# EAGLE design breakout (EAGLE 6.5.0)
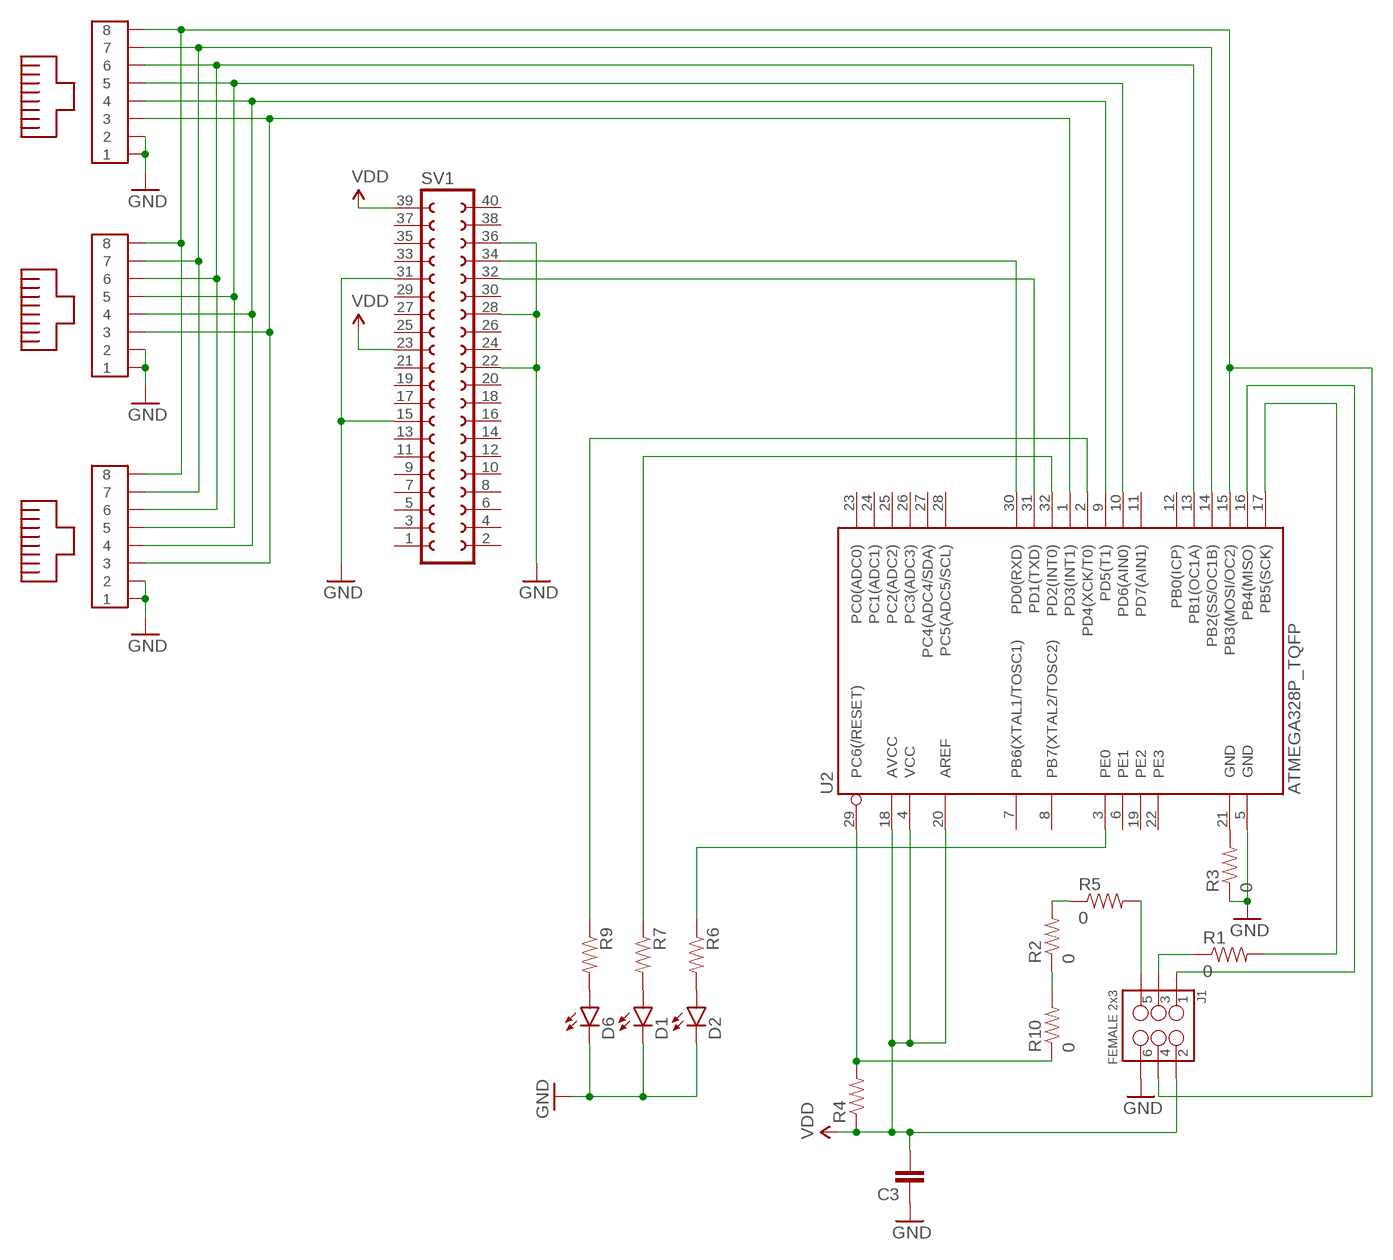
[diagram p0: schematic, sheet 1]

## Parts
C3  CAP1206  [1206]
D1  LED0603  [LED-0603]
D2  LED0603  [LED-0603]
D6  LED0603  [LED-0603]
J1  FEMALE 2x3  M03X2FEMALE  [2X3]
R1  0  RESISTOR1206  [1206]
R2  0  RESISTOR1206  [1206]
R3  0  RESISTOR1206  [1206]
R4  RESISTOR1206  [1206]
R5  0  RESISTOR1206  [1206]
R6  RESISTOR1206  [1206]
R7  RESISTOR1206  [1206]
R9  RESISTOR1206  [1206]
R10  0  RESISTOR1206  [1206]
SV1  FE20-2  [FE20-2]
U2  ATMEGA328P_TQFP  [TQFP32-08]
U$2  MOLEX-RJ45-SMT  [MOLEX-RJ45-SMT]
U$3  MOLEX-RJ45-SMT  [MOLEX-RJ45-SMT]
U$4  MOLEX-RJ45-SMT  [MOLEX-RJ45-SMT]

## Nets
GND: C3.1 D1.C D2.C D6.C J1.6 R3.1 SV1.15 SV1.22 SV1.28 SV1.31 SV1.36 U2.5(GND) U$2.1 U$2.2 U$3.1 U$3.2 U$4.1 U$4.2
N$1: SV1.32 U2.31(PD1(TXD))
N$2: R4.2 R10.1 U2.29(PC6(/RESET))
N$3: U2.9(PD5(T1)) U$2.4 U$3.4 U$4.4
N$4: U2.1(PD3(INT1)) U$2.3 U$3.3 U$4.3
N$5: J1.4 U2.15(PB3(MOSI/OC2)) U$2.8 U$3.8 U$4.8
N$6: U2.10(PD6(AIN0)) U$2.5 U$3.5 U$4.5
N$7: D2.A R6.2
N$8: J1.5 R5.2
N$9: R9.1 U2.2(PD4(XCK/T0))
N$10: SV1.34 U2.30(PD0(RXD))
N$11: J1.3 R1.1
N$12: U2.13(PB1(OC1A)) U$2.6 U$3.6 U$4.6
N$13: U2.14(PB2(SS/OC1B)) U$2.7 U$3.7 U$4.7
N$14: J1.1 U2.16(PB4(MISO))
N$15: R6.1 U2.3(PE0)
N$16: R2.2 R5.1
N$17: R1.2 U2.17(PB5(SCK))
N$18: D1.A R7.2
N$19: R7.1 U2.32(PD2(INT0))
N$20: D6.A R9.2
N$21: R2.1 R10.2
N$22: R3.2 U2.21(GND)
VDD: C3.2 J1.2 R4.1 SV1.23 SV1.39 U2.4(VCC) U2.18(AVCC) U2.20(AREF)
Unconnected: SV1.1 SV1.2 SV1.3 SV1.4 SV1.5 SV1.6 SV1.7 SV1.8 SV1.9 SV1.10 SV1.11 SV1.12 SV1.13 SV1.14 SV1.16 SV1.17 SV1.18 SV1.19 SV1.20 SV1.21 SV1.24 SV1.25 SV1.26 SV1.27 SV1.29 SV1.30 SV1.33 SV1.35 SV1.37 SV1.38 SV1.40 U2.6(PE1) U2.7(PB6(XTAL1/TOSC1)) U2.8(PB7(XTAL2/TOSC2)) U2.11(PD7(AIN1)) U2.12(PB0(ICP)) U2.19(PE2) U2.22(PE3) U2.23(PC0(ADC0)) U2.24(PC1(ADC1)) U2.25(PC2(ADC2)) U2.26(PC3(ADC3)) U2.27(PC4(ADC4/SDA)) U2.28(PC5(ADC5/SCL))

## Library data of the parts
C3 = SparkFun-Capacitors:CAP: Capacitor Standard 0603 ceramic capacitor, and 0.1" leaded capacitor.
D1 D2 D6 = SparkFun-LED:LED: LEDs Standard schematic elements and footprints for 5mm, 3mm, 1206, and 0603 sized LEDs. 5mm - Spark Fun Electronics SKU : COM-00529 (and others)
J1 = SparkFun-Connectors:M03X2: 2x3 .1" header. Shrouded, with keying- CONN-10681 SMT- CONN-11415 Pogo pins- HW-11044; PROD_ID: CONN-11566
R1-R7 R9 R10 = SparkFun-Resistors:RESISTOR: Resistor Basic schematic elements and footprints for 0603, 1206, and PTH resistors.
SV1 = con-lsta:FE20-2: FEMALE HEADER; OC_FARNELL: unknown; OC_NEWARK: unknown
U2 = custom-mlane:ATMEGA328P_TQFP; PROD_ID: IC-09069; VALUE: ATMEGA328PB_TQFP
U$2-U$4 = SMD-RJ45:MOLEX-RJ45-SMT

## Board
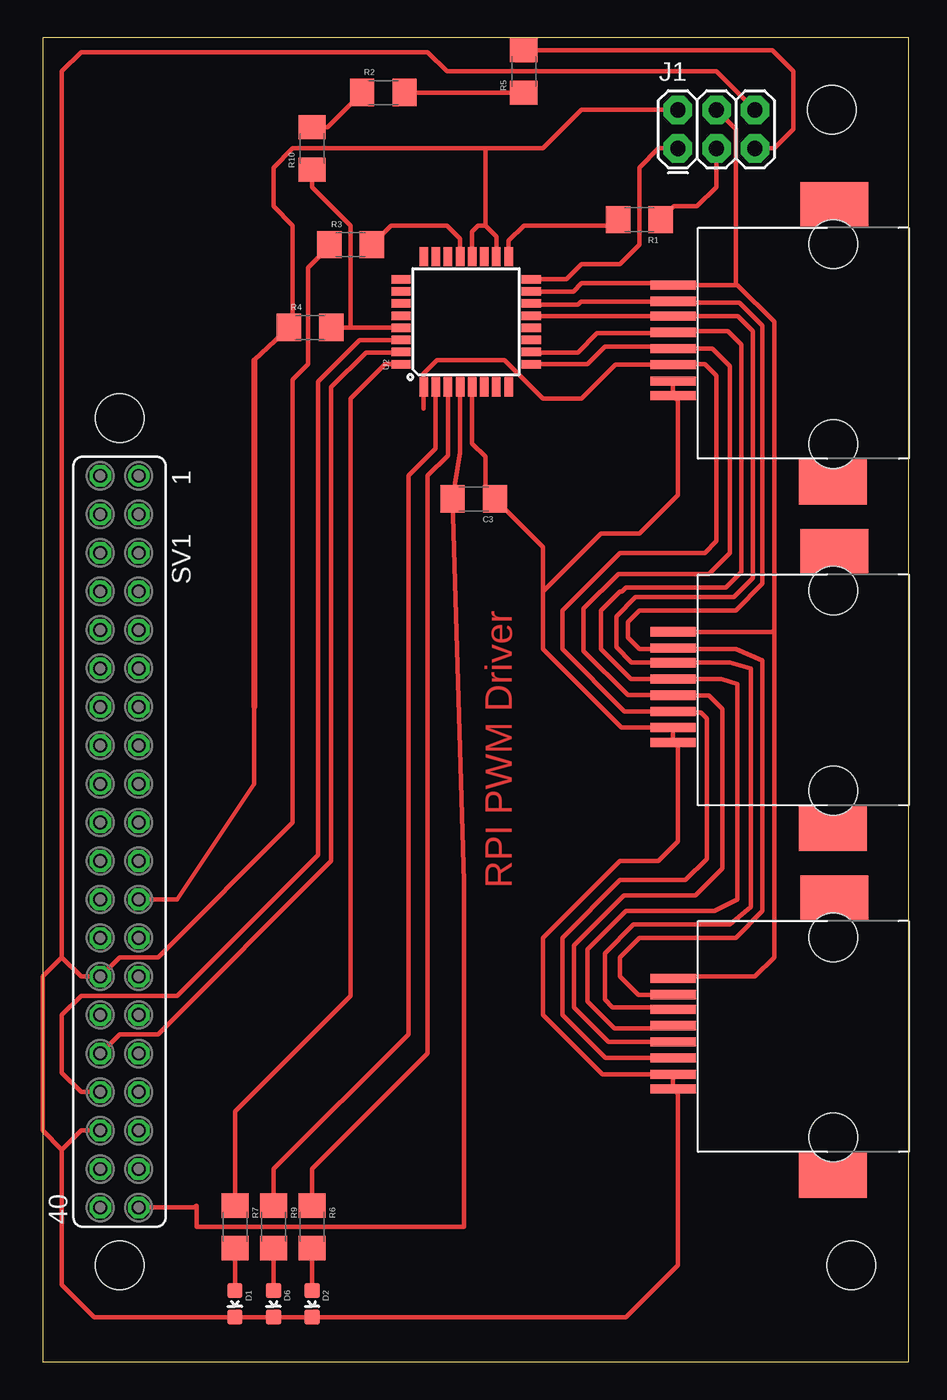
[diagram p1: board, top side]
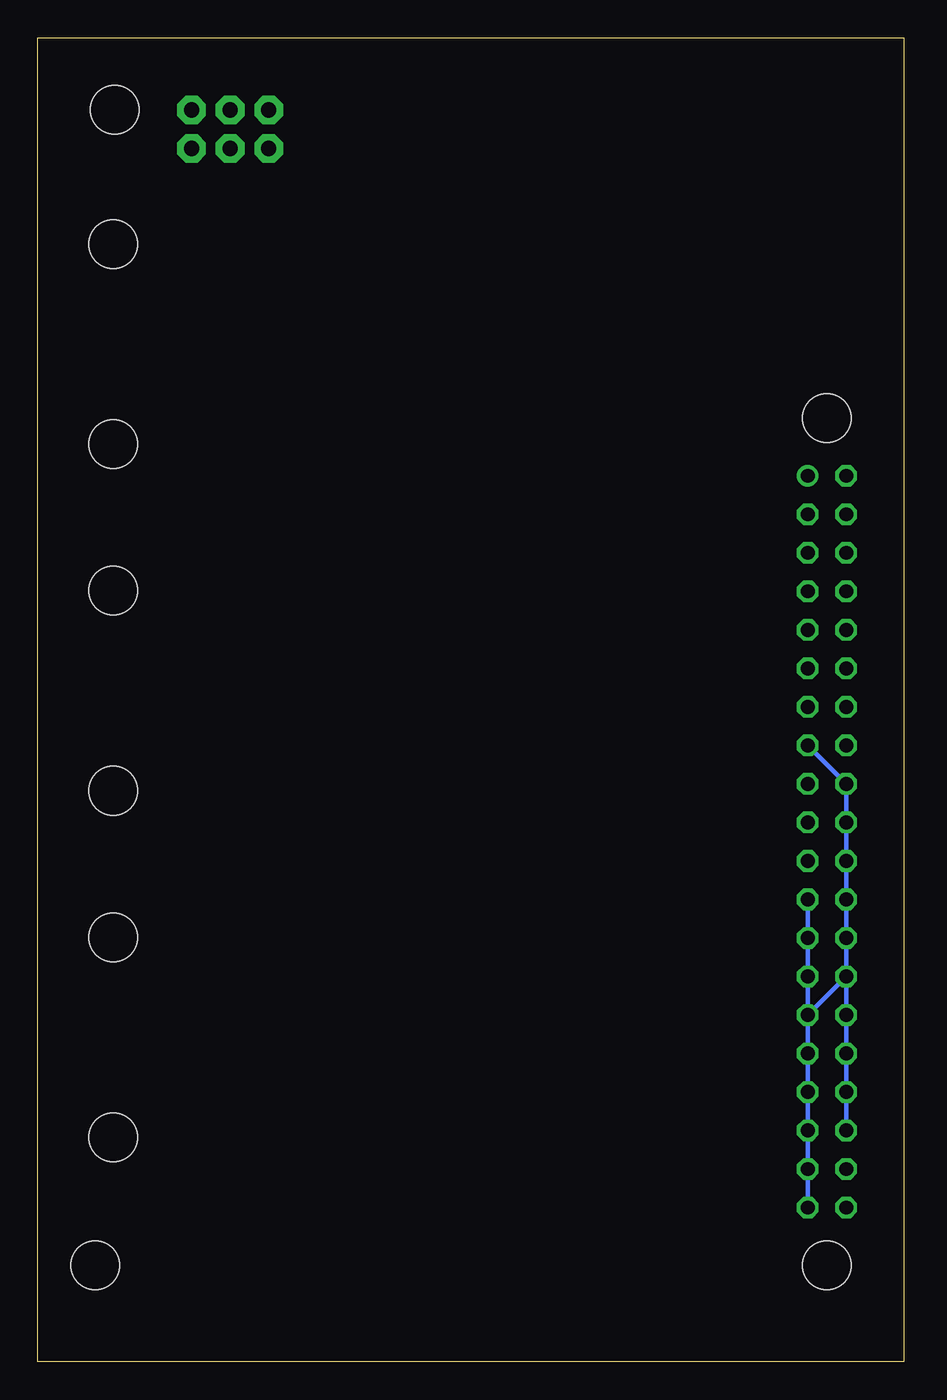
[diagram p2: board, bottom side, seen from below]

Size 57.13 x 87.3 mm. Coordinates in mm from the lower left corner, seen from the top.
Outline: 0,0 57.13,0 57.13,87.3 0,87.3 0,0
Copper layers (1*16): Top 0.035mm / dielectric 1.5mm / Bottom 0.035mm
Design rules "default": minimum track width 10mil, minimum drill 24mil, track to track 8mil, track to pad 8mil, pad to pad 8mil, via to via 8mil, smd to smd 8mil, copper to edge 40mil, drill to drill 8mil, minimum pad ring 10mil, minimum via ring 8mil, stop-mask expansion 4mil, vias tented up to drill 0mil, thermal gap 10mil
Holes 3.2 mm at 52.07,82.55 5.08,6.35 53.34,6.35 5.08,62.23

### Footprints (pad centres in the part's own frame; a part is rotated, then mirrored left to right if it is on the bottom)
1206 = smd 1.6 x 1.8: 1 -1.4,0; 2 1.4,0
LED-0603 = smd 1 x 1: A 0,-0.877; C 0,0.877
2X3 = drill 1.016 pad 1.88 octagon: 1 0,0; 2 0,2.54; 3 2.54,0; 4 2.54,2.54; 5 5.08,0; 6 5.08,2.54
FE20-2 = drill 0.914: 1 -24.13,1.27 | drill 0.914 octagon: 2 -24.13,-1.27; 3 -21.59,1.27; 4 -21.59,-1.27; 5 -19.05,1.27; 6 -19.05,-1.27; 7 -16.51,1.27; 8 -16.51,-1.27; 9 -13.97,1.27; 10 -13.97,-1.27; 11 -11.43,1.27; 12 -11.43,-1.27; 13 -8.89,1.27; 14 -8.89,-1.27; 15 -6.35,1.27; 16 -6.35,-1.27; 17 -3.81,1.27; 18 -3.81,-1.27; 19 -1.27,1.27; 20 -1.27,-1.27; 21 1.27,1.27; 22 1.27,-1.27; 23 3.81,1.27; 24 3.81,-1.27; 25 6.35,1.27; 26 6.35,-1.27; 27 8.89,1.27; 28 8.89,-1.27; 29 11.43,1.27; 30 11.43,-1.27; 31 13.97,1.27; 32 13.97,-1.27; 33 16.51,1.27; 34 16.51,-1.27; 35 19.05,1.27; 36 19.05,-1.27; 37 21.59,1.27; 38 21.59,-1.27; 39 24.13,1.27; 40 24.13,-1.27
TQFP32-08 = smd 1.27 x 0.559: 1 -4.293,2.8; 2 -4.293,2; 3 -4.293,1.2; 4 -4.293,0.4; 5 -4.293,-0.4; 6 -4.293,-1.2; 7 -4.293,-2; 8 -4.293,-2.8; 17 4.293,-2.8; 18 4.293,-2; 19 4.293,-1.2; 20 4.293,-0.4; 21 4.293,0.4; 22 4.293,1.2; 23 4.293,2; 24 4.293,2.8 | smd 0.559 x 1.27: 9 -2.8,-4.293; 10 -2,-4.293; 11 -1.2,-4.293; 12 -0.4,-4.293; 13 0.4,-4.293; 14 1.2,-4.293; 15 2,-4.293; 16 2.8,-4.293; 25 2.8,4.293; 26 2,4.293; 27 1.2,4.293; 28 0.4,4.293; 29 -0.4,4.293; 30 -1.2,4.293; 31 -2,4.293; 32 -2.8,4.293
MOLEX-RJ45-SMT = smd 3 x 0.6: 1 10.48,3.61; 2 10.48,2.64; 3 10.48,1.57; 4 10.48,0.5; 5 10.48,-0.57; 6 10.48,-1.64; 7 10.48,-2.61; 8 10.48,-3.68 | smd 4.5 x 3: P$1 -0.16,-8.97; P$2 -0.06,9.28 | hole 3.2: -0.1,6.8; -0.1,-6.4

### Placement (x,y rotation side)
C3  28.45,56.9 180 top
D1  12.7,3.81 180 top
D2  17.78,3.81 180 top
D6  15.24,3.81 180 top
J1  41.91,80.01 0 top
R1  39.37,75.31 180 top
R2  22.48,83.69 0 top
R3  20.32,73.66 0 top
R4  17.65,68.2 0 top
R5  31.75,85.09 90 top
R6  17.78,8.89 270 top
R7  12.7,8.89 270 top
R9  15.24,8.89 270 top
R10  17.78,80.01 90 top
SV1  5.08,34.29 270 top
U2  27.94,68.58 90 top
U$2  52.07,67.31 180 top
U$3  52.07,21.59 180 top
U$4  52.07,44.45 180 top

### Tracks (layer width: path | path; a pad name or v marks a point on that pad's centre or on a via)
GND
  Top 0.254: 41.91,40.64 U$4.1 41.91,40.64
  Top 0.305: U$2.2 U$2.1 41.91,63.38 41.91,57.15 39.37,54.61 36.83,54.61 33.02,50.8 | 33.02,50.8 33.02,46.99 38.2,41.81 U$4.2 U$4.1 41.91,40.52 41.91,34.29 40.64,33.02 38.1,33.02 33.02,27.94 33.02,22.86 36.93,18.95 U$3.2 U$3.1 41.91,17.66 41.91,6.35 38.49,2.93 D6.C D1.C D2.C 3.42,2.93 1.27,5.08 1.27,13.97 | 1.27,26.67 1.27,85.09 2.54,86.36 25.4,86.36 26.67,85.09 44.45,85.09 J1.6 | 1.27,26.67 2.54,25.4 SV1.28 5.08,26.67 7.62,26.67 16.51,35.56 16.51,64.77 17.53,65.79 17.53,72.14 18.92,73.53 R3.1 | 1.27,13.97 2.54,15.24 SV1.36 | U2.5 28.34,60.56 29.21,59.69 29.21,57.53 C3.1 33.02,53.72 33.02,50.8 | 1.27,26.67 0,25.4 0,15.24 1.27,13.97
  Bottom 0.305: SV1.36 SV1.28 | SV1.28 SV1.22 3.81,38.1 SV1.15 | SV1.28 6.35,22.86 SV1.31
N$1
  Top 0.305: SV1.32 5.08,21.59 7.62,21.59 19.05,33.02 19.05,64.26 21.34,66.55 23.61,66.55 U2.31
N$2
  Top 0.305: U2.29 20.32,68.18 | 20.32,68.18 18.91,68.18 R4.2 | R10.1 17.78,77.47 20.32,74.93 20.32,68.18
N$3
  Top 0.305: U$3.4 37.33,21.09 35.05,23.37 35.05,27.43 38.35,30.73 43.05,30.73 44.83,32.51 44.83,43.05 43.94,43.94 U$4.4 38.6,43.95 35.69,46.86 35.69,49.66 37.97,51.94 43.94,51.94 45.34,53.34 45.34,65.66 44.2,66.8 U$2.4 41.47,66.93 37.08,66.93 35.94,65.79 U2.9
N$4
  Top 0.305: U$3.3 37.13,20.02 34.29,22.86 34.29,27.94 38.1,31.75 42.42,31.75 43.82,33.15 43.82,42.42 43.43,42.8 41.67,42.8 U$4.3 38.4,42.88 34.29,46.99 34.29,49.53 38.1,53.34 43.69,53.34 44.45,54.1 44.45,65.02 43.69,65.79 41.64,65.79 U$2.3 37.8,65.74 35.56,63.5 33.02,63.5 30.48,66.04 26.04,66.04 25.15,65.15 25.15,62.87 U2.1
N$5
  Top 0.305: 45.72,70.99 U$2.8 41.46,71.12 35.56,71.12 35.02,70.58 U2.15 | 45.72,70.99 45.85,70.99 48.26,68.58 48.26,48.26 | 48.26,48.26 48.26,26.67 46.99,25.4 41.72,25.4 U$3.8 | U$4.8 48.13,48.13 48.26,48.26 | J1.4 45.72,81.28 45.72,70.99
N$6
  Top 0.305: U$3.5 41.4,21.97 37.72,21.97 35.94,23.75 35.94,27.18 38.48,29.72 44.32,29.72 45.85,30.48 45.85,44.7 44.77,45.02 U$4.5 38.8,45.02 36.83,46.99 36.83,49.53 38.1,50.8 38.23,50.8 38.48,51.05 45.09,51.05 46.1,52.07 46.1,67.06 45.21,67.95 41.66,67.95 U$2.5 41.53,67.82 36.58,67.82 35.31,66.55 32.27,66.55 U2.10
N$7
  Top 0.305: D2.A R6.2
N$8
  Top 0.305: J1.5 48.26,80.01 49.53,81.28 49.53,85.09 48.13,86.49 R5.2
N$9
  Top 0.305: R9.1 15.24,12.7 24.13,21.59 24.13,58.42 25.94,60.23 U2.2
N$10
  Top 0.305: U2.30 20.9,67.38 18.16,64.64 18.16,61.09 18.16,60.83 18.16,33.4 8.89,24.13 2.54,24.13 1.27,22.86 1.27,19.05 2.54,17.78 SV1.34
N$11
  Top 0.305: J1.3 44.45,77.47 43.18,76.2 41.66,76.2 R1.1
N$12
  Top 0.305: 41.45,46.23 U$4.6 | U$4.6 45.35,46.09 46.74,45.72 46.74,29.97 45.34,28.83 38.99,28.83 37.08,26.92 37.08,23.88 37.59,23.37 41.45,23.37 U$3.6 | U$4.6 41.58,46.1 38.86,46.1 37.85,47.12 37.85,49.15 39.12,50.42 45.59,50.42 46.86,51.69 46.86,67.95 45.86,68.95 U$2.6 41.58,68.96 32.25,68.96 U2.13
N$13
  Top 0.254: 43.18,69.85 41.91,69.85 U$2.7 | 43.18,46.99 41.91,46.99 U$4.7
  Top 0.305: U$3.7 39.3,24.2 38.1,25.4 38.1,26.67 39.37,27.94 45.72,27.94 47.5,29.72 47.5,46.23 45.72,46.99 41.66,46.99 U$4.7 41.52,46.99 39.37,46.99 38.61,47.75 38.61,48.77 39.37,49.53 45.72,49.53 47.5,51.31 47.5,68.33 45.97,69.85 41.91,69.85 | U$2.7 35.5,69.92 35.31,69.72 32.29,69.72 U2.14
N$14
  Top 0.305: U2.16 34.55,71.38 35.56,72.39 38.1,72.39 39.37,73.66 39.37,78.74 40.64,80.01 J1.1
N$15
  Top 0.305: U2.3 26.74,59.76 25.4,58.42 25.4,20.32 17.78,12.7 R6.1
N$16
  Top 0.305: R2.2 R5.1
N$17
  Top 0.305: U2.17 30.74,73.92 31.75,74.93 37.59,74.93 R1.2
N$18
  Top 0.305: D1.A R7.2
N$19
  Top 0.305: U2.32 22.6,65.78 20.32,63.5 20.32,24.13 12.7,16.51 R7.1
N$20
  Top 0.305: D6.A R9.2
N$21
  Top 0.305: R10.2 18.8,81.41 R2.1
N$22
  Top 0.305: U2.21 27.54,74.06 26.67,74.93 22.99,74.93 R3.2
VDD
  Top 0.305: SV1.39 10.03,10.16 10.09,10.22 | SV1.23 8.89,30.48 13.97,38.1 13.97,43.18 | 10.16,10.29 10.09,10.22 | U2.4 27.54,59.96 C3.2 27.81,31.62 27.81,8.89 10.16,8.89 10.16,10.22 10.09,10.22 | U2.20 28.34,74.53 28.74,74.93 29.21,74.93 | 13.97,66.04 R4.1 16,68.07 16.51,68.58 16.51,74.93 15.24,76.2 15.24,78.74 16.51,80.01 29.21,80.01 | U2.18 29.94,74.2 29.21,74.93 | J1.2 35.56,82.55 33.02,80.01 29.21,80.01 | 29.21,74.93 29.21,80.01
  Top 0.406: 13.97,66.04 13.97,43.18
  Bottom 0.305: SV1.23 SV1.39

### Text on the board
Top: RPI PWM Driver